# EAGLE design 6cm_tvtr_RF (EAGLE 6.2)
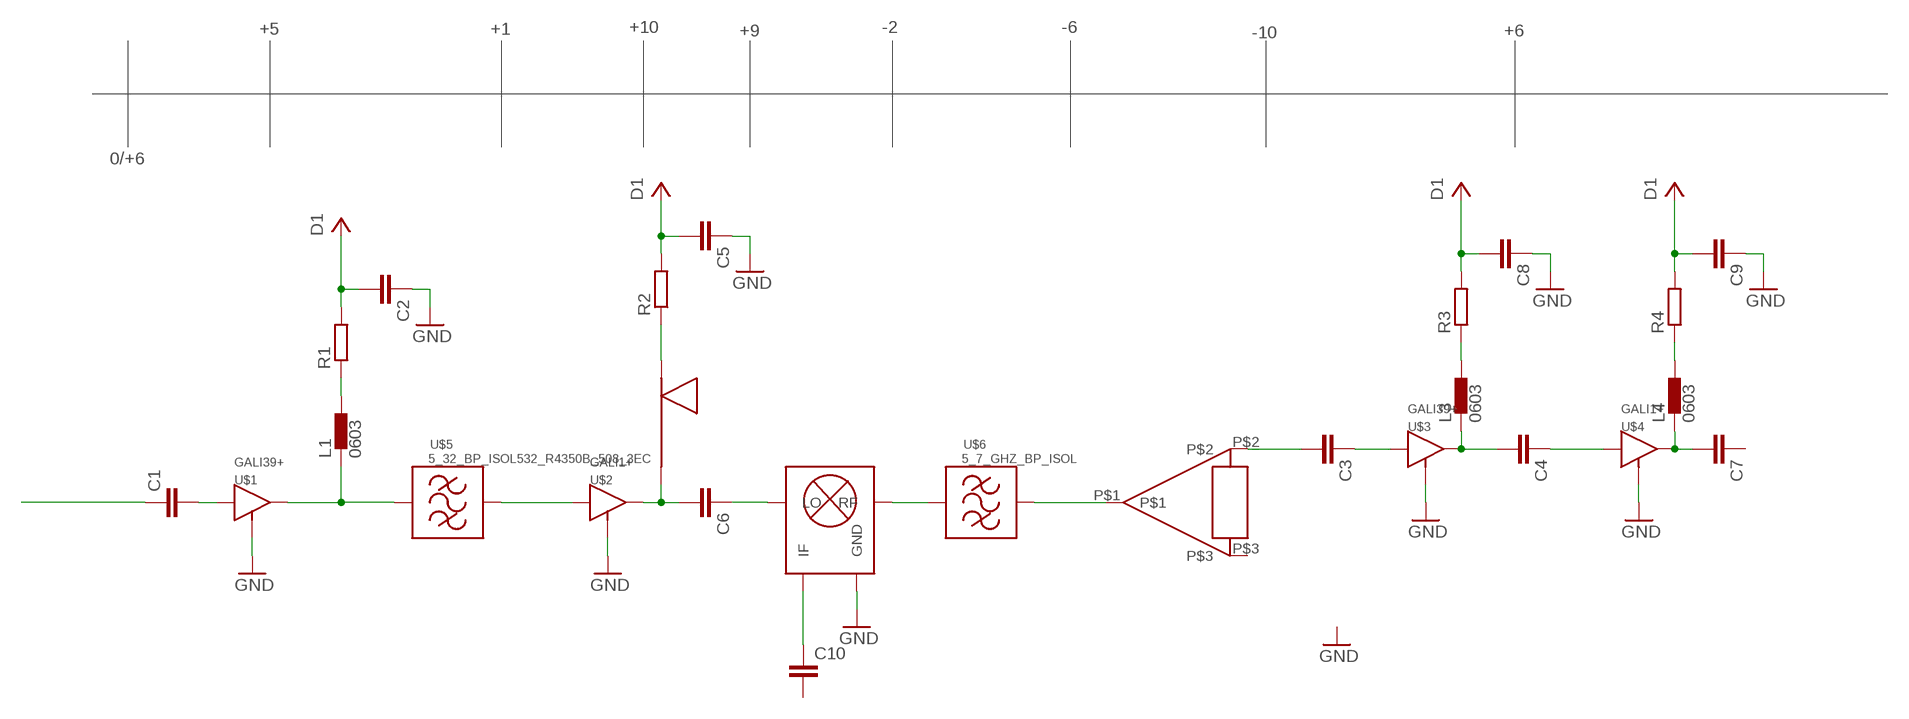
[diagram p0: schematic, sheet 1]

## Parts
C1  C-EUC0603K  [C0603K]
C2  C-EUC0603K  [C0603K]
C3  C-EUC0603K  [C0603K]
C4  C-EUC0603K  [C0603K]
C5  C-EUC0603K  [C0603K]
C6  C-EUC0603K  [C0603K]
C7  C-EUC0603K  [C0603K]
C8  C-EUC0603K  [C0603K]
C9  C-EUC0603K  [C0603K]
C10  C-EUC0603K  [C0603K]
L1  0603  [0603]
L3  0603  [0603]
L4  0603  [0603]
R1  R-EU_R0603  [R0603]
R2  R-EU_R0603  [R0603]
R3  R-EU_R0603  [R0603]
R4  R-EU_R0603  [R0603]
U$1  GALI39+  [DF782]
U$2  GALI1+  [DF782]
U$3  GALI39+  [DF782]
U$4  GALI1+  [DF782]
U$5  5_32_BP_ISOL532_R4350B_508_3EC  [532_R4350B_508_3EC]
U$6  5_7_GHZ_BP_ISOL  [576_R403C_508_5TH]
U$7  576_WILK  [576_WILK]
U$8  MDB-73H+  [DG1847]
U$9  STUB  [5.3_R4350B_508_STUB_90]

## Nets
D1: C5.2 C8.2 C9.2 R2.2 R3.2 R4.2
GND: C2.1 C5.1 C8.1 C9.1 U$1.P$2(GND) U$1.P$4(GND) U$1.P$5(GND) U$1.P$6(GND) U$1.P$7(GND) U$1.P$8(GND) U$2.P$2(GND) U$2.P$4(GND) U$2.P$5(GND) U$2.P$6(GND) U$2.P$7(GND) U$2.P$8(GND) U$3.P$2(GND) U$3.P$4(GND) U$3.P$5(GND) U$3.P$6(GND) U$3.P$7(GND) U$3.P$8(GND) U$4.P$2(GND) U$4.P$4(GND) U$4.P$5(GND) U$4.P$6(GND) U$4.P$7(GND) U$4.P$8(GND) U$8.P$2(GND) U$8.P$4(GND) U$8.P$8(GND) U$8.P$10(GND) U$8.P$15(GND) U$8.P$17(GND) U$8.PAD1(GND) U$8.PAD2(GND) U$8.PAD3(GND) U$8.PAD4(GND)
N$1: C1.2 U$1.P$1(IN)
N$2: R2.1 U$9.DC
N$3: C6.2 U$2.P$3(OUT) U$9.RF(RF_END)
N$4: L1.P$2 R1.1
N$5: L1.P$1 U$1.P$3(OUT) U$5.P$1
N$6: U$2.P$1(IN) U$5.P$2
N$7: U$6.P$2 U$7.P$1
N$8: C1.1
N$9: C6.1 U$8.P$16(LO)
N$10: C3.2 U$7.P$2
N$11: U$6.P$1 U$8.P$3(RF)
N$12: C3.1 U$3.P$1(IN)
N$13: C4.2 L3.P$1 U$3.P$3(OUT)
N$14: C4.1 U$4.P$1(IN)
N$15: C7.2 L4.P$1 U$4.P$3(OUT)
N$16: L3.P$2 R3.1
N$17: L4.P$2 R4.1
N$18: C10.1 U$8.P$9(IF)
VCC: C2.2 R1.2 ; supply symbol labelled D1
Unconnected: C7.1 C10.2 U$7.P$3

## Notes on the sheet
- +5 | +1 | +10 | +9 | -2 | -6 | +6
- -10
- 0/+6

## Library data of the parts
C1-C10 = rcl:C-EU: CAPACITOR, European symbol
L1 L3 L4 = inductors:0603
R1-R4 = resistor:R-EU_: RESISTOR, European symbol
U$1 U$3 = RF:GALI39+
U$2 U$4 = RF:GALI1+
U$5 = microstrip:5_32_BP_ISOL
U$6 = microstrip:5_7_GHZ_BP_ISOL
U$7 = RF:576_WILK
U$8 = microstrip:MDB-73H+
U$9 = microstrip:STUB

## Board
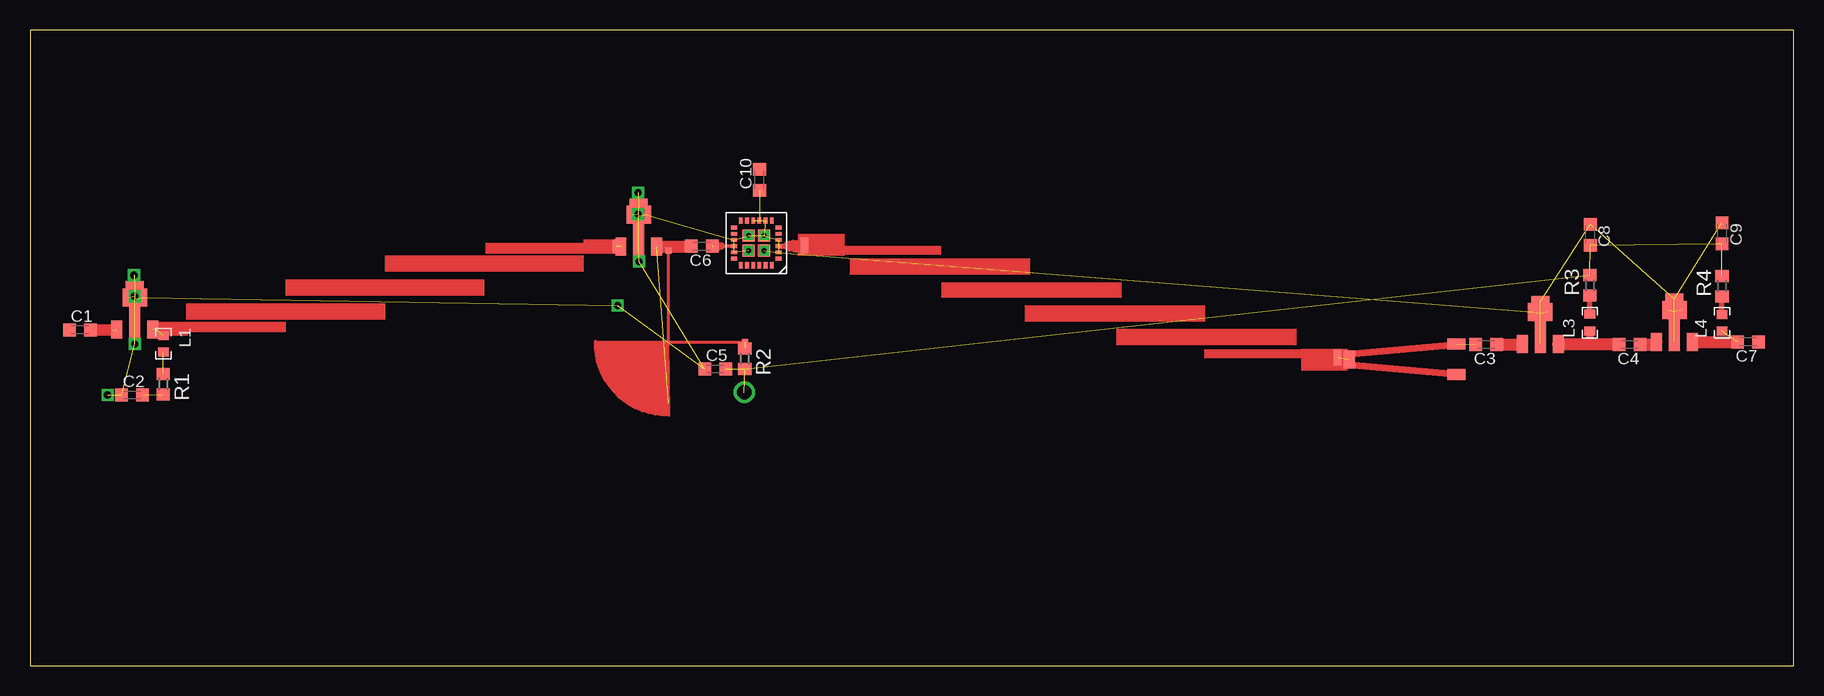
[diagram p1: board, top side]

Size 147 x 53 mm. Coordinates in mm from the lower left corner, seen from the top.
Outline: 0,0 147,0 147,53 0,53 0,0
Copper layers (1*16): Top 0.035mm / dielectric 1.5mm / Bottom 0.035mm
Design rules: minimum track width 10mil, minimum drill 24mil, track to track 8mil, track to pad 8mil, pad to pad 8mil, via to via 8mil, smd to smd 8mil, copper to edge 40mil, drill to drill 8mil, minimum pad ring 10mil, minimum via ring 8mil, stop-mask expansion 4mil, vias tented up to drill 0mil, thermal gap 10mil

### Footprints (pad centres in the part's own frame; a part is rotated, then mirrored left to right if it is on the bottom)
C0603K = smd 1.05 x 1.08: 1 -0.875,0; 2 0.875,0
0603 = smd 0.75 x 0.9: P$1 -0.7,0; P$2 0.7,0
R0603 = smd 1 x 1.1: 1 -0.85,0; 2 0.85,0
DF782 = smd 0.914 x 1.499: P$1 -1.499,0; P$2 0,0; P$3 1.499,0; P$4 0,1.27; P$5 0,2.54; P$6 -0.572,2.667; P$7 0.572,2.667 | smd 1.499 x 0.914: P$8 0,3.556
532_R4350B_508_3EC = smd 0.5 x 1.13: P$1 35.745,7.142; P$2 -2.715,0.288
576_R403C_508_5TH = smd 0.635 x 1.27: P$1 -3.8,2.384; P$2 40.667,-6.932
576_WILK = smd 0.914 x 1.499: P$1 0,0 | smd 1.499 x 0.914: P$2 8.89,1.27; P$3 8.89,-1.27
DG1847 = smd 0.51 x 0.31: P$1 -1.855,1.295; P$2 -1.855,0.777; P$3 -1.855,0.259; P$4 -1.855,-0.259; P$5 -1.855,-0.777; P$6 -1.855,-1.295; P$13 1.855,-1.295; P$14 1.855,-0.777; P$15 1.855,-0.259; P$16 1.855,0.259; P$17 1.855,0.777; P$18 1.855,1.295 | smd 0.31 x 0.51: P$7 -1.295,-1.855; P$8 -0.777,-1.855; P$9 -0.259,-1.855; P$10 0.259,-1.855; P$11 0.777,-1.855; P$12 1.295,-1.855; P$19 1.295,1.855; P$20 0.777,1.855; P$21 0.259,1.855; P$22 -0.259,1.855; P$23 -0.777,1.855; P$24 -1.295,1.855 | smd 1 x 1: PAD1 -0.635,0.635; PAD2 0.635,0.635; PAD3 -0.635,-0.635; PAD4 0.635,-0.635
5.3_R4350B_508_STUB_90 = smd 0.5 x 0.5: DC -6.35,0; RF 0,-7.62

### Placement (x,y rotation side)
C1  4.17,27.99 0 top
C2  8.51,22.56 0 top
C3  121.37,26.77 180 top
C4  133.34,26.77 180 top
C5  57.12,24.73 0 top
C6  55.99,34.97 180 top
C7  143.2,26.99 180 top
C8  130.04,35.93 270 top
C9  141.04,36.05 270 top
C10  60.81,40.51 90 top
L1  11.12,26.83 270 top
L3  130.03,28.6 90 top
L4  141.04,28.59 90 top
R1  11.12,23.47 270 top
R2  59.59,25.58 270 top
R3  130.03,31.71 90 top
R4  141.04,31.63 90 top
U$1  8.74,28.03 0 top
U$2  50.75,34.92 0 top
U$3  125.89,26.79 0 top
U$4  137.08,26.99 0 top
U$5  46.15,35.23 180 top
U$6  68.34,32.61 0 top
U$7  109.99,25.53 0 top
U$8  60.54,35.23 180 top
U$9  53.24,26.99 180 top

### Tracks (layer width: path | path; a pad name or v marks a point on that pad's centre or on a via)
D1  (via drill 1.2)  (6 unrouted)
  other vias: 59.54,22.78
GND  (via drill 0.4, 0.6)  (49 unrouted)
  other vias: 6.47,22.57 48.97,30.01 50.78,33.7 8.74,26.82 8.67,32.54 8.72,30.79 50.68,39.43 50.68,37.64 59.89,35.87 61.2,35.88 59.91,34.6 61.19,34.61
N$1  (1 unrouted)
  Top 1.016: 6.87,27.95 C1.2
N$2  (1 unrouted)
N$3  (1 unrouted)
  Top 1.016: U$2.P$3 55.07,34.92 C6.2
N$4  (1 unrouted)
N$5  (2 unrouted)
N$6  (1 unrouted)
N$7  (1 unrouted)
N$9  (1 unrouted)
  Top 0.305: U$8.P$16 58.72,34.98 57.61,34.98
  Top 0.61: 57.61,34.98 57.1,34.97
  Top 1.016: 57.1,34.97 57,34.99
N$10  (1 unrouted)
N$11
  Top 0.406: U$8.P$3 63.21,34.98
  Top 0.813: 63.21,34.98 63.65,34.98
  Top 1.016: 63.65,34.98 U$6.P$1
N$12
  Top 1.016: C3.1 124.39,26.77 U$3.P$1
N$13
  Top 0.61: L3.P$1 130.03,26.84 130.08,26.79
  Top 1.016: U$3.P$3 130.08,26.79 132.46,26.79 C4.2
N$14
  Top 1.016: C4.1 135.36,26.77 U$4.P$1
N$15  (1 unrouted)
  Top 1.016: U$4.P$3 C7.2
N$16
  Top 0.406: L3.P$2 R3.1
N$17
  Top 0.406: L4.P$2 R4.1
N$18  (1 unrouted)
VCC  (1 unrouted)